# Altium schematic sheet Top.SchDoc: STM32F7 Discovery Interconnexion
size A4; Date: 25-FEB-2015; Author: A.B; CompanyName: STMicroelectronics; Address1: 12, Rue Jules HOROWITZ; Address2: 38019 Grenoble; Address3: FRANCE; DocumentNumber: MB1191; Revision: B-02; SheetNumber: 2; SheetTotal: 14; Project: STM32F746G-DISCO
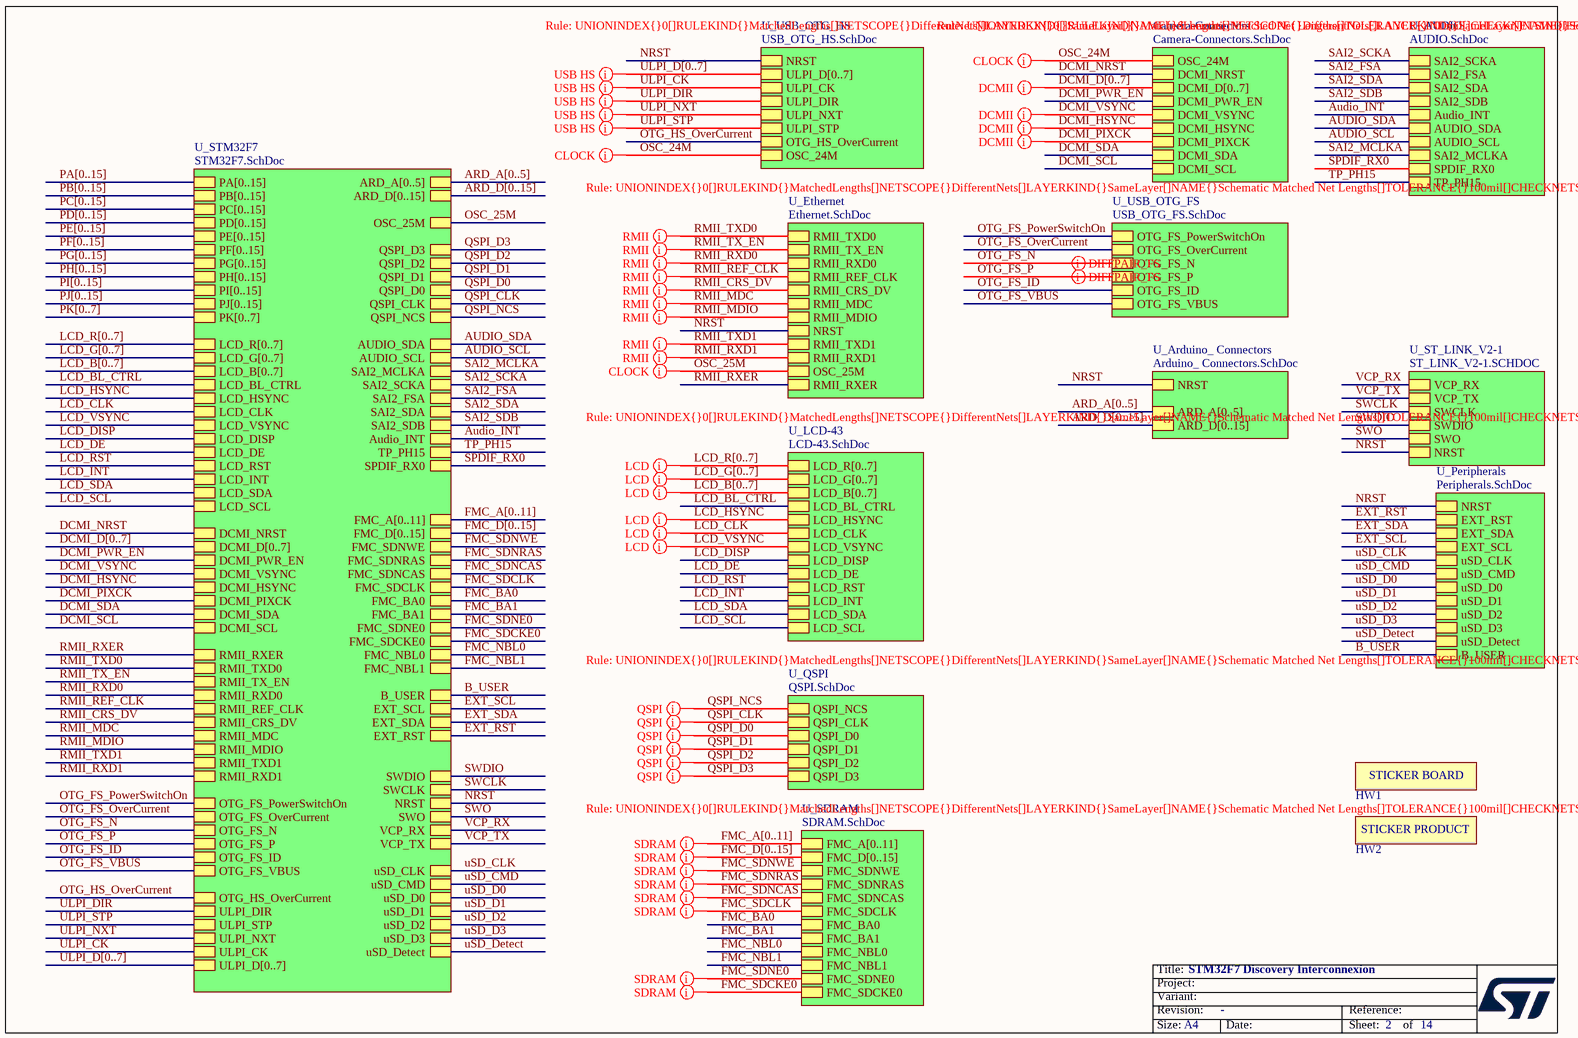
[diagram p0: Top.SchDoc]

## Parts
HW1  STICKER_BOARD  (value not drawn)  (no BOM)
HW2  STICKER_PRODUCT  (value not drawn)  (no BOM)

## Sub-sheets
Camera-Connectors = Camera-Connectors.SchDoc: OSC_24M, DCMI_NRST, DCMI_D[0..7], DCMI_PWR_EN, DCMI_VSYNC, DCMI_HSYNC, DCMI_PIXCK, DCMI_SDA, DCMI_SCL
U_Arduino_ Connectors = Arduino_ Connectors.SchDoc: NRST, ARD_A[0..5], ARD_D[0..15]
U_AUDIO = AUDIO.SchDoc: AUDIO_SDA, AUDIO_SCL, SAI2_MCLKA, SPDIF_RX0, TP_PH15, SAI2_SCKA, SAI2_FSA, SAI2_SDA, SAI2_SDB, Audio_INT
U_Ethernet = Ethernet.SchDoc: RMII_TXD0, RMII_TX_EN, RMII_RXD0, RMII_REF_CLK, RMII_CRS_DV, RMII_MDC, RMII_MDIO, NRST, RMII_TXD1, RMII_RXD1, OSC_25M, RMII_RXER
U_LCD-43 = LCD-43.SchDoc: LCD_R[0..7], LCD_BL_CTRL, LCD_B[0..7], LCD_G[0..7], LCD_HSYNC, LCD_CLK, LCD_VSYNC, LCD_DISP, LCD_DE, LCD_RST, LCD_INT, LCD_SDA, LCD_SCL
U_Peripherals = Peripherals.SchDoc: NRST, EXT_RST, EXT_SCL, EXT_SDA, uSD_CLK, uSD_CMD, uSD_D0, uSD_D1, uSD_D2, uSD_D3, uSD_Detect, B_USER
U_QSPI = QSPI.SchDoc: QSPI_D0, QSPI_D3, QSPI_D1, QSPI_CLK, QSPI_NCS, QSPI_D2
U_SDRAM = SDRAM.SchDoc: FMC_A[0..11], FMC_D[0..15], FMC_SDNWE, FMC_SDNRAS, FMC_SDNCAS, FMC_SDCLK, FMC_BA0, FMC_BA1, FMC_NBL0, FMC_NBL1, FMC_SDNE0, FMC_SDCKE0
U_ST_LINK_V2-1 = ST_LINK_V2-1.SCHDOC: SWDIO, SWCLK, NRST, VCP_RX, VCP_TX, SWO
U_STM32F7 = STM32F7.SchDoc: PA[0..15], PB[0..15], PC[0..15], PD[0..15], PE[0..15], PF[0..15], PG[0..15], PH[0..15], PI[0..15], PJ[0..15], PK[0..7], OSC_25M, LCD_R[0..7], LCD_BL_CTRL, LCD_B[0..7], LCD_G[0..7], LCD_HSYNC, LCD_CLK, LCD_VSYNC, LCD_DISP, LCD_DE, LCD_RST, LCD_INT, LCD_SDA, LCD_SCL, DCMI_NRST, DCMI_D[0..7], DCMI_PWR_EN, DCMI_VSYNC, DCMI_HSYNC, DCMI_PIXCK, DCMI_SDA, DCMI_SCL, RMII_TXD0, RMII_TX_EN, RMII_RXD0, RMII_REF_CLK, RMII_CRS_DV, RMII_MDC, RMII_MDIO, RMII_TXD1, RMII_RXD1, ULPI_D[0..7], ULPI_CK, ULPI_DIR, ULPI_NXT, ULPI_STP, OTG_FS_N, OTG_FS_P, OTG_FS_ID, OTG_FS_VBUS, OTG_FS_PowerSwitchOn, OTG_FS_OverCurrent, QSPI_D0, QSPI_D3, QSPI_D1, QSPI_CLK, QSPI_NCS, AUDIO_SDA, AUDIO_SCL, SAI2_MCLKA, EXT_SCL, EXT_SDA, EXT_RST, uSD_CLK, uSD_CMD, uSD_D0, uSD_D1, uSD_D2, uSD_D3, uSD_Detect, SWDIO, SWCLK, NRST, SWO, VCP_RX, VCP_TX, FMC_A[0..11], FMC_D[0..15], FMC_SDNWE, FMC_SDNRAS, FMC_SDNCAS, FMC_SDCLK, FMC_BA0, FMC_BA1, FMC_SDNE0, FMC_SDCKE0, FMC_NBL0, FMC_NBL1, SPDIF_RX0, QSPI_D2, B_USER, ARD_A[0..5], ARD_D[0..15], RMII_RXER, OTG_HS_OverCurrent, SAI2_SCKA, SAI2_FSA, SAI2_SDA, SAI2_SDB, Audio_INT, TP_PH15
U_USB_OTG_FS = USB_OTG_FS.SchDoc: OTG_FS_PowerSwitchOn, OTG_FS_OverCurrent, OTG_FS_N, OTG_FS_P, OTG_FS_ID, OTG_FS_VBUS
U_USB_OTG_HS = USB_OTG_HS.SchDoc: ULPI_D[0..7], ULPI_CK, ULPI_DIR, ULPI_NXT, ULPI_STP, OSC_24M, NRST, OTG_HS_OverCurrent

## Nets
Audio_INT: sheet U_AUDIO/Audio_INT, sheet U_STM32F7/Audio_INT
AUDIO_SCL: sheet U_AUDIO/AUDIO_SCL, sheet U_STM32F7/AUDIO_SCL
AUDIO_SDA: sheet U_AUDIO/AUDIO_SDA, sheet U_STM32F7/AUDIO_SDA
B_USER: sheet U_Peripherals/B_USER, sheet U_STM32F7/B_USER
DCMI_HSYNC: sheet U_STM32F7/DCMI_HSYNC, sheet Camera-Connectors/DCMI_HSYNC
DCMI_NRST: sheet U_STM32F7/DCMI_NRST, sheet Camera-Connectors/DCMI_NRST
DCMI_PIXCK: sheet U_STM32F7/DCMI_PIXCK, sheet Camera-Connectors/DCMI_PIXCK
DCMI_PWR_EN: sheet U_STM32F7/DCMI_PWR_EN, sheet Camera-Connectors/DCMI_PWR_EN
DCMI_SCL: sheet U_STM32F7/DCMI_SCL, sheet Camera-Connectors/DCMI_SCL
DCMI_SDA: sheet U_STM32F7/DCMI_SDA, sheet Camera-Connectors/DCMI_SDA
DCMI_VSYNC: sheet U_STM32F7/DCMI_VSYNC, sheet Camera-Connectors/DCMI_VSYNC
EXT_RST: sheet U_Peripherals/EXT_RST, sheet U_STM32F7/EXT_RST
EXT_SCL: sheet U_Peripherals/EXT_SCL, sheet U_STM32F7/EXT_SCL
EXT_SDA: sheet U_Peripherals/EXT_SDA, sheet U_STM32F7/EXT_SDA
FMC_BA0: sheet U_SDRAM/FMC_BA0, sheet U_STM32F7/FMC_BA0
FMC_BA1: sheet U_SDRAM/FMC_BA1, sheet U_STM32F7/FMC_BA1
FMC_NBL0: sheet U_SDRAM/FMC_NBL0, sheet U_STM32F7/FMC_NBL0
FMC_NBL1: sheet U_SDRAM/FMC_NBL1, sheet U_STM32F7/FMC_NBL1
FMC_SDCKE0: sheet U_SDRAM/FMC_SDCKE0, sheet U_STM32F7/FMC_SDCKE0
FMC_SDCLK: sheet U_SDRAM/FMC_SDCLK, sheet U_STM32F7/FMC_SDCLK
FMC_SDNCAS: sheet U_SDRAM/FMC_SDNCAS, sheet U_STM32F7/FMC_SDNCAS
FMC_SDNE0: sheet U_SDRAM/FMC_SDNE0, sheet U_STM32F7/FMC_SDNE0
FMC_SDNRAS: sheet U_SDRAM/FMC_SDNRAS, sheet U_STM32F7/FMC_SDNRAS
FMC_SDNWE: sheet U_SDRAM/FMC_SDNWE, sheet U_STM32F7/FMC_SDNWE
LCD_BL_CTRL: sheet U_LCD-43/LCD_BL_CTRL, sheet U_STM32F7/LCD_BL_CTRL
LCD_CLK: sheet U_LCD-43/LCD_CLK, sheet U_STM32F7/LCD_CLK
LCD_DE: sheet U_LCD-43/LCD_DE, sheet U_STM32F7/LCD_DE
LCD_DISP: sheet U_LCD-43/LCD_DISP, sheet U_STM32F7/LCD_DISP
LCD_HSYNC: sheet U_LCD-43/LCD_HSYNC, sheet U_STM32F7/LCD_HSYNC
LCD_INT: sheet U_LCD-43/LCD_INT, sheet U_STM32F7/LCD_INT
LCD_RST: sheet U_LCD-43/LCD_RST, sheet U_STM32F7/LCD_RST
LCD_SCL: sheet U_LCD-43/LCD_SCL, sheet U_STM32F7/LCD_SCL
LCD_SDA: sheet U_LCD-43/LCD_SDA, sheet U_STM32F7/LCD_SDA
LCD_VSYNC: sheet U_LCD-43/LCD_VSYNC, sheet U_STM32F7/LCD_VSYNC
NRST: sheet U_ST_LINK_V2-1/NRST, sheet U_Peripherals/NRST, sheet U_Arduino_ Connectors/NRST, sheet U_USB_OTG_HS/NRST, sheet U_STM32F7/NRST, sheet U_Ethernet/NRST
OSC_24M: sheet U_USB_OTG_HS/OSC_24M, sheet Camera-Connectors/OSC_24M
OSC_25M: sheet U_STM32F7/OSC_25M, sheet U_Ethernet/OSC_25M
OTG_FS_ID: sheet U_USB_OTG_FS/OTG_FS_ID, sheet U_STM32F7/OTG_FS_ID
OTG_FS_N: sheet U_USB_OTG_FS/OTG_FS_N, sheet U_STM32F7/OTG_FS_N
OTG_FS_OverCurrent: sheet U_USB_OTG_FS/OTG_FS_OverCurrent, sheet U_STM32F7/OTG_FS_OverCurrent
OTG_FS_P: sheet U_USB_OTG_FS/OTG_FS_P, sheet U_STM32F7/OTG_FS_P
OTG_FS_PowerSwitchOn: sheet U_USB_OTG_FS/OTG_FS_PowerSwitchOn, sheet U_STM32F7/OTG_FS_PowerSwitchOn
OTG_FS_VBUS: sheet U_USB_OTG_FS/OTG_FS_VBUS, sheet U_STM32F7/OTG_FS_VBUS
OTG_HS_OverCurrent: sheet U_USB_OTG_HS/OTG_HS_OverCurrent, sheet U_STM32F7/OTG_HS_OverCurrent
QSPI_CLK: sheet U_QSPI/QSPI_CLK, sheet U_STM32F7/QSPI_CLK
QSPI_D0: sheet U_QSPI/QSPI_D0, sheet U_STM32F7/QSPI_D0
QSPI_D1: sheet U_QSPI/QSPI_D1, sheet U_STM32F7/QSPI_D1
QSPI_D2: sheet U_QSPI/QSPI_D2, sheet U_STM32F7/QSPI_D2
QSPI_D3: sheet U_QSPI/QSPI_D3, sheet U_STM32F7/QSPI_D3
QSPI_NCS: sheet U_QSPI/QSPI_NCS, sheet U_STM32F7/QSPI_NCS
RMII_CRS_DV: sheet U_STM32F7/RMII_CRS_DV, sheet U_Ethernet/RMII_CRS_DV
RMII_MDC: sheet U_STM32F7/RMII_MDC, sheet U_Ethernet/RMII_MDC
RMII_MDIO: sheet U_STM32F7/RMII_MDIO, sheet U_Ethernet/RMII_MDIO
RMII_REF_CLK: sheet U_STM32F7/RMII_REF_CLK, sheet U_Ethernet/RMII_REF_CLK
RMII_RXD0: sheet U_STM32F7/RMII_RXD0, sheet U_Ethernet/RMII_RXD0
RMII_RXD1: sheet U_STM32F7/RMII_RXD1, sheet U_Ethernet/RMII_RXD1
RMII_RXER: sheet U_STM32F7/RMII_RXER, sheet U_Ethernet/RMII_RXER
RMII_TX_EN: sheet U_STM32F7/RMII_TX_EN, sheet U_Ethernet/RMII_TX_EN
RMII_TXD0: sheet U_STM32F7/RMII_TXD0, sheet U_Ethernet/RMII_TXD0
RMII_TXD1: sheet U_STM32F7/RMII_TXD1, sheet U_Ethernet/RMII_TXD1
SAI2_FSA: sheet U_AUDIO/SAI2_FSA, sheet U_STM32F7/SAI2_FSA
SAI2_MCLKA: sheet U_AUDIO/SAI2_MCLKA, sheet U_STM32F7/SAI2_MCLKA
SAI2_SCKA: sheet U_AUDIO/SAI2_SCKA, sheet U_STM32F7/SAI2_SCKA
SAI2_SDA: sheet U_AUDIO/SAI2_SDA, sheet U_STM32F7/SAI2_SDA
SAI2_SDB: sheet U_AUDIO/SAI2_SDB, sheet U_STM32F7/SAI2_SDB
SPDIF_RX0: sheet U_AUDIO/SPDIF_RX0, sheet U_STM32F7/SPDIF_RX0
SWCLK: sheet U_ST_LINK_V2-1/SWCLK, sheet U_STM32F7/SWCLK
SWDIO: sheet U_ST_LINK_V2-1/SWDIO, sheet U_STM32F7/SWDIO
SWO: sheet U_ST_LINK_V2-1/SWO, sheet U_STM32F7/SWO
TP_PH15: sheet U_AUDIO/TP_PH15, sheet U_STM32F7/TP_PH15
ULPI_CK: sheet U_USB_OTG_HS/ULPI_CK, sheet U_STM32F7/ULPI_CK
ULPI_DIR: sheet U_USB_OTG_HS/ULPI_DIR, sheet U_STM32F7/ULPI_DIR
ULPI_NXT: sheet U_USB_OTG_HS/ULPI_NXT, sheet U_STM32F7/ULPI_NXT
ULPI_STP: sheet U_USB_OTG_HS/ULPI_STP, sheet U_STM32F7/ULPI_STP
uSD_CLK: sheet U_Peripherals/uSD_CLK, sheet U_STM32F7/uSD_CLK
uSD_CMD: sheet U_Peripherals/uSD_CMD, sheet U_STM32F7/uSD_CMD
uSD_D0: sheet U_Peripherals/uSD_D0, sheet U_STM32F7/uSD_D0
uSD_D1: sheet U_Peripherals/uSD_D1, sheet U_STM32F7/uSD_D1
uSD_D2: sheet U_Peripherals/uSD_D2, sheet U_STM32F7/uSD_D2
uSD_D3: sheet U_Peripherals/uSD_D3, sheet U_STM32F7/uSD_D3
uSD_Detect: sheet U_Peripherals/uSD_Detect, sheet U_STM32F7/uSD_Detect
VCP_RX: sheet U_ST_LINK_V2-1/VCP_RX, sheet U_STM32F7/VCP_RX
VCP_TX: sheet U_ST_LINK_V2-1/VCP_TX, sheet U_STM32F7/VCP_TX

## Buses and harness runs
bus ARD_A[0..5] = sheet U_Arduino_ Connectors/ARD_A[0..5]
bus ARD_A[0..5] = sheet U_STM32F7/ARD_A[0..5]
bus ARD_D[0..15] = sheet U_Arduino_ Connectors/ARD_D[0..15]
bus ARD_D[0..15] = sheet U_STM32F7/ARD_D[0..15]
bus DCMI_D[0..7] = sheet Camera-Connectors/DCMI_D[0..7]
bus DCMI_D[0..7] = sheet U_STM32F7/DCMI_D[0..7]
bus FMC_A[0..11] = sheet U_SDRAM/FMC_A[0..11]
bus FMC_A[0..11] = sheet U_STM32F7/FMC_A[0..11]
bus FMC_D[0..15] = sheet U_SDRAM/FMC_D[0..15]
bus FMC_D[0..15] = sheet U_STM32F7/FMC_D[0..15]
bus LCD_B[0..7] = sheet U_LCD-43/LCD_B[0..7]
bus LCD_B[0..7] = sheet U_STM32F7/LCD_B[0..7]
bus LCD_G[0..7] = sheet U_LCD-43/LCD_G[0..7]
bus LCD_G[0..7] = sheet U_STM32F7/LCD_G[0..7]
bus LCD_R[0..7] = sheet U_LCD-43/LCD_R[0..7]
bus LCD_R[0..7] = sheet U_STM32F7/LCD_R[0..7]
bus PA[0..15] = sheet U_STM32F7/PA[0..15]
bus PB[0..15] = sheet U_STM32F7/PB[0..15]
bus PC[0..15] = sheet U_STM32F7/PC[0..15]
bus PD[0..15] = sheet U_STM32F7/PD[0..15]
bus PE[0..15] = sheet U_STM32F7/PE[0..15]
bus PF[0..15] = sheet U_STM32F7/PF[0..15]
bus PG[0..15] = sheet U_STM32F7/PG[0..15]
bus PH[0..15] = sheet U_STM32F7/PH[0..15]
bus PI[0..15] = sheet U_STM32F7/PI[0..15]
bus PJ[0..15] = sheet U_STM32F7/PJ[0..15]
bus PK[0..7] = sheet U_STM32F7/PK[0..7]
bus ULPI_D[0..7] = sheet U_STM32F7/ULPI_D[0..7]
bus ULPI_D[0..7] = sheet U_USB_OTG_HS/ULPI_D[0..7]

## Layout directives
rule Matched Net Lengths [Tolerance = 100mil]: (no net found under the mark), DCMI_HSYNC, DCMI_PIXCK, DCMI_VSYNC, FMC_SDCKE0, FMC_SDCLK, FMC_SDNCAS, FMC_SDNE0, FMC_SDNRAS, FMC_SDNWE, LCD_CLK, LCD_HSYNC, LCD_VSYNC, QSPI_CLK, QSPI_D0, QSPI_D1, QSPI_D2, QSPI_D3, QSPI_NCS, RMII_CRS_DV, RMII_MDC, RMII_MDIO, RMII_REF_CLK, RMII_RXD0, RMII_RXD1, RMII_TX_EN, RMII_TXD0, RMII_TXD1, ULPI_CK, ULPI_DIR, ULPI_NXT, ULPI_STP
rule Undefined: OSC_24M, OSC_25M
differential pair: OTG_FS_N, OTG_FS_P

## Notes on the sheet
- Title:
- Project:
- Size:
- Revision:
- Variant:
- A4
- -
- Date:
- Reference:
- Sheet:
- of
- (in symbol STICKER_BOARD) STICKER BOARD
- (in symbol STICKER_PRODUCT) STICKER PRODUCT